# EAGLE board OSD62-PM-BRK (EAGLE 9.6.2), part 1 of 3
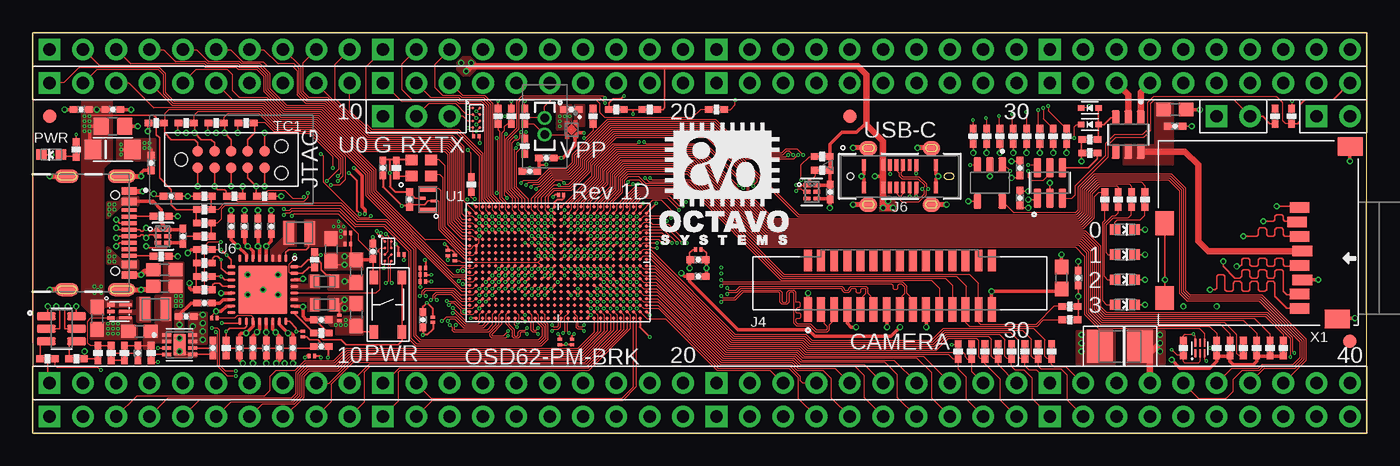
[diagram p9: board, top side]
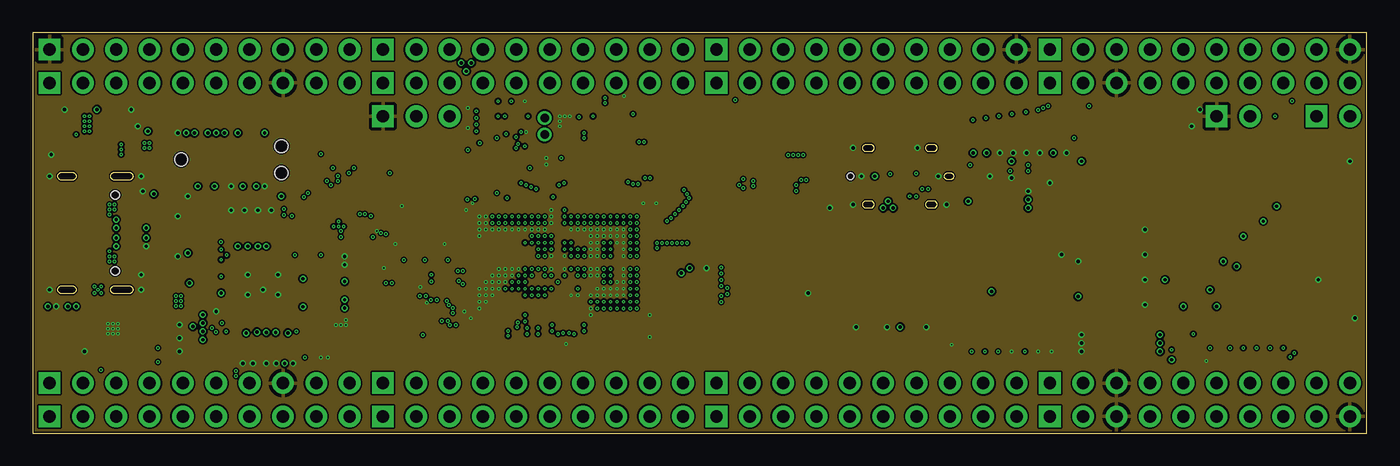
[diagram p10: board, inner layer Route2]
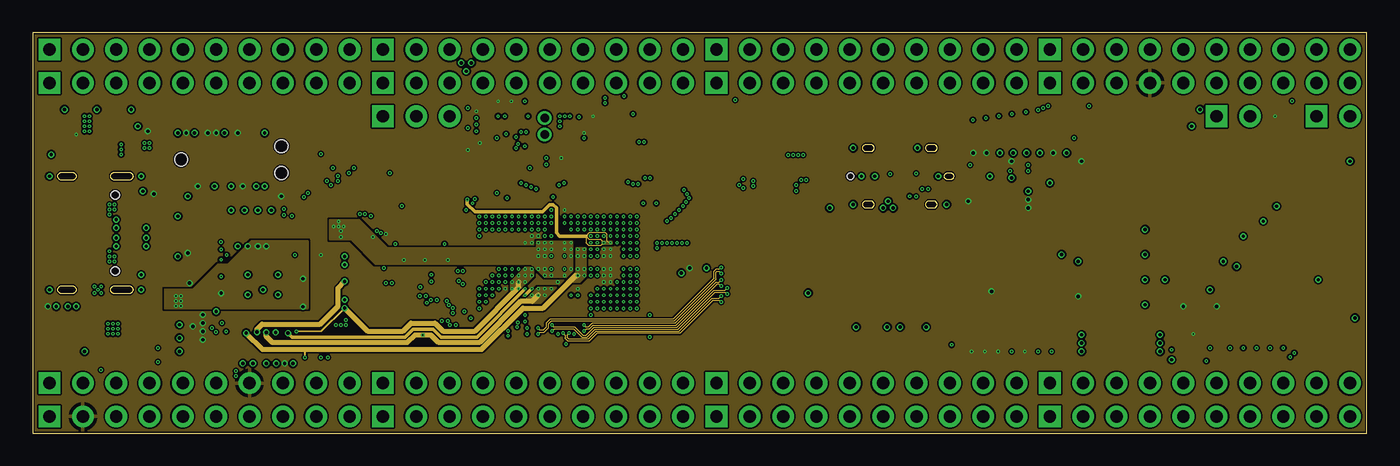
[diagram p11: board, inner layer Route15]
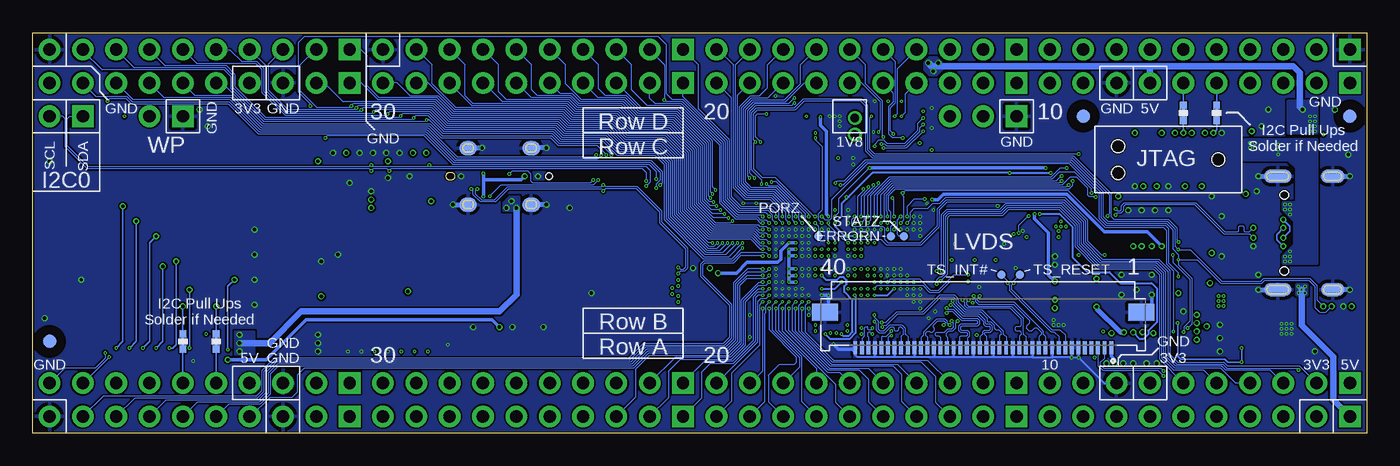
[diagram p12: board, bottom side, seen from below]

Size 101.6 x 30.48 mm. Coordinates in mm from the lower left corner, seen from the top.
Outline: 0,0 101.6,0 101.6,30.48 0,30.48 0,0
Copper layers (1+2*15+16): Top 0.035mm / dielectric 0.23mm / Route2 0.035mm / dielectric 0.93mm / Route15 0.035mm / dielectric 0.23mm / Bottom 0.035mm
Design rules "OSD32MP15x-BRK_Board_4lyr *": minimum track width 3mil, minimum drill 4mil, track to track 3mil, track to pad 3mil, pad to pad 3mil, via to via 3mil, smd to smd 3mil, copper to edge 5mil, drill to drill 4mil, minimum pad ring 3mil, minimum via ring 3mil, stop-mask expansion 3mil, vias tented up to drill 25mil, thermal gap 10mil

## Footprints (pad centres in the part's own frame; a part is rotated, then mirrored left to right if it is on the bottom)
C0201 = smd 0.23 x 0.34: 1 -0.205,0; 2 0.205,0
C0402 = smd 0.61 x 0.508: 1 -0.559,0; 2 0.559,0
B/3528-21R = smd 1.95 x 2.5: + 1.525,0; - -1.525,0
C0603 = smd 1.1 x 1: 1 -0.85,0; 2 0.85,0
C0805 = smd 1.143 x 1.27: 1 -0.889,0; 2 0.889,0
EIA-STD = smd 0.787 x 0.787: 1 -0.749,0; 2 0.749,0
RB520S30T1G = smd 0.48 x 0.4: ANODE 0.66,0; CATHODE -0.66,0
SOD-123FL = smd 1.25 x 1.5: A 1.5,0; C -1.5,0
FIDUCIAL_40MIL = smd 1.016 x 1.016: P$1 0,0
H1X2-1.27 = drill 0.65 pad 1.05: 1 -0.635,0; 2 0.635,0
H1X2-2.54 = drill 0.94 pad 1.651 square: 1 0,1.27 | drill 0.94 pad 1.651: 2 0,-1.27
TE_1-1734248-5 = smd 0.6 x 1.85: 1 -7,-2.025; 2 -6,-2.025; 3 -5,-2.025; 4 -4,-2.025; 5 -3,-2.025; 6 -2,-2.025; 7 -1,-2.025; 8 0,-2.025; 9 1,-2.025; 10 2,-2.025; 11 3,-2.025; 12 4,-2.025; 13 5,-2.025; 14 6,-2.025; 15 7,-2.025 | smd 0.6 x 1.65: 1_1 -7,1.725; 2_1 -6,1.725; 3_1 -5,1.725; 4_1 -4,1.725; 5_1 -3,1.725; 6_1 -2,1.725; 7_1 -1,1.725; 8_1 0,1.725; 9_1 1,1.725; 10_1 2,1.725; 11_1 3,1.725; 12_1 4,1.725; 13_1 5,1.725; 14_1 6,1.725; 15_1 7,1.725
GCT_USB4105-GF-A = smd 0.6 x 1.15: A1_B12 -3.2,4.755; A4_B9 -2.4,4.755; B1_A12 3.2,4.755; B4_A9 2.4,4.755 | smd 0.3 x 1.15: A5 -1.25,4.755; A6 -0.25,4.755; A7 0.25,4.755; A8 1.25,4.755; B5 1.75,4.755; B6 0.75,4.755; B7 -0.75,4.755; B8 -1.75,4.755 | smd 1 x 2.1 bottom: SH1_B -4.32,4.18; SH2_B 4.32,4.18 | smd 1 x 2.1: SH1_T -4.32,4.18; SH2_T 4.32,4.18 | smd 1 x 1.8 bottom: SH3_B 4.32,0; SH4_B -4.32,0 | smd 1 x 1.8: SH3_T 4.32,0; SH4_T -4.32,0 | hole 0.65: 2.89,3.68; -2.89,3.68
MOLEX_2171820001 = smd 0.3 x 0.87: A1 -2.75,0.865; A4 -1.25,0.865; A5 -0.75,0.865; A6 -0.25,0.865; A7 0.25,0.865; A8 0.75,0.865; A9 1.25,0.865; A12 2.75,0.865; B1 2.75,-0.865; B4 1.25,-0.865; B5 0.75,-0.865; B6 0.25,-0.865; B7 -0.25,-0.865; B8 -0.75,-0.865; B9 -1.25,-0.865; B12 -2.75,-0.865 | smd 1.35 x 1.1 bottom: SH_B_1 -2.4,2.15; SH_B_2 2.4,2.15; SH_B_3 2.4,-2.15; SH_B_4 -2.4,-2.15 | smd 1.35 x 1.1: SH_T_1 -2.4,2.15; SH_T_2 2.4,2.15; SH_T_3 2.4,-2.15; SH_T_4 -2.4,-2.15 | hole 0.52: -3.75,0
MOLEX_505110-4091 = smd 0.3 x 1: 1 -9.75,2.425; 2 -9.25,2.425; 3 -8.75,2.425; 4 -8.25,2.425; 5 -7.75,2.425; 6 -7.25,2.425; 7 -6.75,2.425; 8 -6.25,2.425; 9 -5.75,2.425; 10 -5.25,2.425; 11 -4.75,2.425; 12 -4.25,2.425; 13 -3.75,2.425; 14 -3.25,2.425; 15 -2.75,2.425; 16 -2.25,2.425; 17 -1.75,2.425; 18 -1.25,2.425; 19 -0.75,2.425; 20 -0.25,2.425; 21 0.25,2.425; 22 0.75,2.425; 23 1.25,2.425; 24 1.75,2.425; 25 2.25,2.425; 26 2.75,2.425; 27 3.25,2.425; 28 3.75,2.425; 29 4.25,2.425; 30 4.75,2.425; 31 5.25,2.425; 32 5.75,2.425; 33 6.25,2.425; 34 6.75,2.425; 35 7.25,2.425; 36 7.75,2.425; 37 8.25,2.425; 38 8.75,2.425; 39 9.25,2.425; 40 9.75,2.425 | smd 2 x 1.3: S1 -12.05,-0.275; S2 12.05,-0.275
H1X3-2.54 = drill 0.94 pad 1.651 square: 1 0,2.54 | drill 0.94 pad 1.651: 2 0,0; 3 0,-2.54
H1X40-2.54 = drill 0.94 pad 1.651 square: 1 0,49.53; 11 0,24.13; 21 0,-1.27; 31 0,-26.67 | drill 0.94 pad 1.651: 2 0,46.99; 3 0,44.45; 4 0,41.91; 5 0,39.37; 6 0,36.83; 7 0,34.29; 8 0,31.75; 9 0,29.21; 10 0,26.67; 12 0,21.59; 13 0,19.05; 14 0,16.51; 15 0,13.97; 16 0,11.43; 17 0,8.89; 18 0,6.35; 19 0,3.81; 20 0,1.27; 22 0,-3.81; 23 0,-6.35; 24 0,-8.89; 25 0,-11.43; 26 0,-13.97; 27 0,-16.51; 28 0,-19.05; 29 0,-21.59; 30 0,-24.13; 32 0,-29.21; 33 0,-31.75; 34 0,-34.29; 35 0,-36.83; 36 0,-39.37; 37 0,-41.91; 38 0,-44.45; 39 0,-46.99; 40 0,-49.53
L0806 = smd 0.8 x 1.8: 1 -0.8,0; 2 0.8,0
L0603 = smd 0.7 x 1: 1 -0.75,0; 2 0.75,0
R0402 = smd 0.61 x 0.508: 1 -0.559,0; 2 0.559,0
TACT4.2MM = smd 1.05 x 0.65: P$1 -2.075,1.075; P$2 2.075,1.075; P$3 -2.075,-1.075; P$4 2.075,-1.075
TC2050-IDC-NL = smd 0.787 x 0.787: 1 -2.54,-0.635; 2 -1.27,-0.635; 3 0,-0.635; 4 1.27,-0.635; 5 2.54,-0.635; 6 2.54,0.635; 7 1.27,0.635; 8 0,0.635; 9 -1.27,0.635; 10 -2.54,0.635 | hole 0.991: -3.81,0; 3.81,1.016; 3.81,-1.016
TP_B0,65 = smd 0.635 x 0.635: TP 0,0
OSD6254-BGA-500 = smd 0.25 x 0.25: A2 -6.25,4.25; A3 -5.75,4.25; A4 -5.25,4.25; A5 -4.75,4.25; A6 -4.25,4.25; A7 -3.75,4.25; A8 -3.25,4.25; A9 -2.75,4.25; A10 -2.25,4.25; A11 -1.75,4.25; A12 -1.25,4.25; A13 -0.75,4.25; A14 -0.25,4.25; A15 0.25,4.25; A16 0.75,4.25; A17 1.25,4.25; A18 1.75,4.25; A19 2.25,4.25; A20 2.75,4.25; A21 3.25,4.25; A22 3.75,4.25; A23 4.25,4.25; A24 4.75,4.25; A25 5.25,4.25; A26 5.75,4.25; A27 6.25,4.25; B1 -6.75,3.75; B2 -6.25,3.75; B3 -5.75,3.75; B4 -5.25,3.75; B5 -4.75,3.75; B6 -4.25,3.75; B7 -3.75,3.75; B8 -3.25,3.75; B9 -2.75,3.75; B10 -2.25,3.75; B11 -1.75,3.75; B12 -1.25,3.75; B13 -0.75,3.75; B14 -0.25,3.75; B15 0.25,3.75; B16 0.75,3.75; B17 1.25,3.75; B18 1.75,3.75; B19 2.25,3.75; B20 2.75,3.75; B21 3.25,3.75; B22 3.75,3.75; B23 4.25,3.75; B24 4.75,3.75; B25 5.25,3.75; B26 5.75,3.75; B27 6.25,3.75; B28 6.75,3.75; C1 -6.75,3.25; C2 -6.25,3.25; C3 -5.75,3.25; C4 -5.25,3.25; C5 -4.75,3.25; C6 -4.25,3.25; C7 -3.75,3.25; C8 -3.25,3.25; C9 -2.75,3.25; C10 -2.25,3.25; C11 -1.75,3.25; C12 -1.25,3.25; C13 -0.75,3.25; C14 -0.25,3.25; C15 0.25,3.25; C16 0.75,3.25; C17 1.25,3.25; C18 1.75,3.25; C19 2.25,3.25; C20 2.75,3.25; C21 3.25,3.25; C22 3.75,3.25; C23 4.25,3.25; C24 4.75,3.25; C25 5.25,3.25; C26 5.75,3.25; C27 6.25,3.25; C28 6.75,3.25; D1 -6.75,2.75; D2 -6.25,2.75; D3 -5.75,2.75; D4 -5.25,2.75; D5 -4.75,2.75; D6 -4.25,2.75; D7 -3.75,2.75; D8 -3.25,2.75; D9 -2.75,2.75; D10 -2.25,2.75; D11 -1.75,2.75; D12 -1.25,2.75; D13 -0.75,2.75; D14 -0.25,2.75; D15 0.25,2.75; D16 0.75,2.75; D17 1.25,2.75; D18 1.75,2.75; D19 2.25,2.75; D20 2.75,2.75; D21 3.25,2.75; D22 3.75,2.75; D23 4.25,2.75; D24 4.75,2.75; D25 5.25,2.75; D26 5.75,2.75; D27 6.25,2.75; D28 6.75,2.75; E1 -6.75,2.25; E2 -6.25,2.25; E3 -5.75,2.25; E4 -5.25,2.25; E5 -4.75,2.25; E6 -4.25,2.25; E7 -3.75,2.25; E8 -3.25,2.25; E9 -2.75,2.25; E10 -2.25,2.25; E11 -1.75,2.25; E12 -1.25,2.25; E13 -0.75,2.25; E14 -0.25,2.25; E15 0.25,2.25; E16 0.75,2.25; E17 1.25,2.25; E18 1.75,2.25; E19 2.25,2.25; E20 2.75,2.25; E21 3.25,2.25; E22 3.75,2.25; E23 4.25,2.25; E24 4.75,2.25; E25 5.25,2.25; E26 5.75,2.25; E27 6.25,2.25; E28 6.75,2.25; F1 -6.75,1.75; F2 -6.25,1.75; F3 -5.75,1.75; F4 -5.25,1.75; F5 -4.75,1.75; F6 -4.25,1.75; F7 -3.75,1.75; F8 -3.25,1.75; F9 -2.75,1.75; F10 -2.25,1.75; F11 -1.75,1.75; F12 -1.25,1.75; F13 -0.75,1.75; F14 -0.25,1.75; F15 0.25,1.75; F16 0.75,1.75; F17 1.25,1.75; F18 1.75,1.75; F19 2.25,1.75; F20 2.75,1.75; F21 3.25,1.75; F22 3.75,1.75; F23 4.25,1.75; F24 4.75,1.75; F25 5.25,1.75; F26 5.75,1.75; F27 6.25,1.75; F28 6.75,1.75; G1 -6.75,1.25; G2 -6.25,1.25; G3 -5.75,1.25; G4 -5.25,1.25; G5 -4.75,1.25; G6 -4.25,1.25; G7 -3.75,1.25; G8 -3.25,1.25; G9 -2.75,1.25; G10 -2.25,1.25; G11 -1.75,1.25; G12 -1.25,1.25; G13 -0.75,1.25; G14 -0.25,1.25; G15 0.25,1.25; G16 0.75,1.25; G17 1.25,1.25; G18 1.75,1.25; G19 2.25,1.25; G20 2.75,1.25; G21 3.25,1.25; G22 3.75,1.25; G23 4.25,1.25; G24 4.75,1.25; G25 5.25,1.25; G26 5.75,1.25; G27 6.25,1.25; G28 6.75,1.25; H1 -6.75,0.75; H2 -6.25,0.75; H3 -5.75,0.75; H4 -5.25,0.75; H5 -4.75,0.75; H6 -4.25,0.75; H7 -3.75,0.75; H8 -3.25,0.75; H9 -2.75,0.75; H10 -2.25,0.75; H11 -1.75,0.75; H12 -1.25,0.75; H13 -0.75,0.75; H14 -0.25,0.75; H15 0.25,0.75; H16 0.75,0.75; H17 1.25,0.75; H18 1.75,0.75; H19 2.25,0.75; H20 2.75,0.75; H21 3.25,0.75; H22 3.75,0.75; H23 4.25,0.75; H24 4.75,0.75; H25 5.25,0.75; H26 5.75,0.75; H27 6.25,0.75; H28 6.75,0.75; J1 -6.75,0.25; J2 -6.25,0.25; J3 -5.75,0.25; J4 -5.25,0.25; J5 -4.75,0.25; J6 -4.25,0.25; J7 -3.75,0.25; J8 -3.25,0.25; J9 -2.75,0.25; J10 -2.25,0.25; J11 -1.75,0.25; J12 -1.25,0.25; J13 -0.75,0.25; J14 -0.25,0.25; J15 0.25,0.25; J16 0.75,0.25; J17 1.25,0.25; J18 1.75,0.25; J19 2.25,0.25; J20 2.75,0.25; J21 3.25,0.25; J22 3.75,0.25; J23 4.25,0.25; J24 4.75,0.25; J25 5.25,0.25; J26 5.75,0.25; J27 6.25,0.25; J28 6.75,0.25; K1 -6.75,-0.25; K2 -6.25,-0.25; K3 -5.75,-0.25; K4 -5.25,-0.25; K5 -4.75,-0.25; K6 -4.25,-0.25; K7 -3.75,-0.25; K8 -3.25,-0.25; K9 -2.75,-0.25; K10 -2.25,-0.25; K11 -1.75,-0.25; K12 -1.25,-0.25; K13 -0.75,-0.25; K14 -0.25,-0.25; K15 0.25,-0.25; K16 0.75,-0.25; K17 1.25,-0.25; K18 1.75,-0.25; K19 2.25,-0.25; K20 2.75,-0.25; K21 3.25,-0.25; K22 3.75,-0.25; K23 4.25,-0.25; K24 4.75,-0.25; K25 5.25,-0.25; K26 5.75,-0.25; K27 6.25,-0.25; K28 6.75,-0.25; L1 -6.75,-0.75; L2 -6.25,-0.75; L3 -5.75,-0.75; L4 -5.25,-0.75; L5 -4.75,-0.75; L6 -4.25,-0.75; L7 -3.75,-0.75; L8 -3.25,-0.75; L9 -2.75,-0.75; L10 -2.25,-0.75; L11 -1.75,-0.75; L12 -1.25,-0.75; L13 -0.75,-0.75; L14 -0.25,-0.75; L15 0.25,-0.75; L16 0.75,-0.75; L17 1.25,-0.75; L18 1.75,-0.75; L19 2.25,-0.75; L20 2.75,-0.75; L21 3.25,-0.75; L22 3.75,-0.75; L23 4.25,-0.75; L24 4.75,-0.75; L25 5.25,-0.75; L26 5.75,-0.75; L27 6.25,-0.75; L28 6.75,-0.75; M1 -6.75,-1.25; M2 -6.25,-1.25; M3 -5.75,-1.25; M4 -5.25,-1.25; M5 -4.75,-1.25; M6 -4.25,-1.25; M7 -3.75,-1.25; M8 -3.25,-1.25; M9 -2.75,-1.25; M10 -2.25,-1.25; M11 -1.75,-1.25; M12 -1.25,-1.25; M13 -0.75,-1.25; M14 -0.25,-1.25; M15 0.25,-1.25; M16 0.75,-1.25; M17 1.25,-1.25; M18 1.75,-1.25; M19 2.25,-1.25; M20 2.75,-1.25; M21 3.25,-1.25; M22 3.75,-1.25; M23 4.25,-1.25; M24 4.75,-1.25; M25 5.25,-1.25; M26 5.75,-1.25; M27 6.25,-1.25; M28 6.75,-1.25; N1 -6.75,-1.75; N2 -6.25,-1.75; N3 -5.75,-1.75; N4 -5.25,-1.75; N5 -4.75,-1.75; N6 -4.25,-1.75; N7 -3.75,-1.75; N8 -3.25,-1.75; N9 -2.75,-1.75; N10 -2.25,-1.75; N11 -1.75,-1.75; N12 -1.25,-1.75; N13 -0.75,-1.75; N14 -0.25,-1.75; N15 0.25,-1.75; N16 0.75,-1.75; N17 1.25,-1.75; N18 1.75,-1.75; N19 2.25,-1.75; N20 2.75,-1.75; N21 3.25,-1.75; N22 3.75,-1.75; N23 4.25,-1.75; N24 4.75,-1.75; N25 5.25,-1.75; N26 5.75,-1.75; N27 6.25,-1.75; N28 6.75,-1.75; P1 -6.75,-2.25; P2 -6.25,-2.25; P3 -5.75,-2.25; P4 -5.25,-2.25; P5 -4.75,-2.25; P6 -4.25,-2.25; P7 -3.75,-2.25; P8 -3.25,-2.25; P9 -2.75,-2.25; P10 -2.25,-2.25; P11 -1.75,-2.25; P12 -1.25,-2.25; P13 -0.75,-2.25; P14 -0.25,-2.25; P15 0.25,-2.25; P16 0.75,-2.25; P17 1.25,-2.25; P18 1.75,-2.25; P19 2.25,-2.25; P20 2.75,-2.25; P21 3.25,-2.25; P22 3.75,-2.25; P23 4.25,-2.25; P24 4.75,-2.25; P25 5.25,-2.25; P26 5.75,-2.25; P27 6.25,-2.25; P28 6.75,-2.25; R1 -6.75,-2.75; R2 -6.25,-2.75; R3 -5.75,-2.75; R4 -5.25,-2.75; R5 -4.75,-2.75; R6 -4.25,-2.75; R7 -3.75,-2.75; R8 -3.25,-2.75; R9 -2.75,-2.75; R10 -2.25,-2.75; R11 -1.75,-2.75; R12 -1.25,-2.75; R13 -0.75,-2.75; R14 -0.25,-2.75; R15 0.25,-2.75; R16 0.75,-2.75; R17 1.25,-2.75; R18 1.75,-2.75; R19 2.25,-2.75; R20 2.75,-2.75; R21 3.25,-2.75; R22 3.75,-2.75; R23 4.25,-2.75; R24 4.75,-2.75; R25 5.25,-2.75; R26 5.75,-2.75; R27 6.25,-2.75; R28 6.75,-2.75; T1 -6.75,-3.25; T2 -6.25,-3.25; T3 -5.75,-3.25; T4 -5.25,-3.25; T5 -4.75,-3.25; T6 -4.25,-3.25; T7 -3.75,-3.25; T8 -3.25,-3.25; T9 -2.75,-3.25; T10 -2.25,-3.25; T11 -1.75,-3.25; T12 -1.25,-3.25; T13 -0.75,-3.25; T14 -0.25,-3.25; T15 0.25,-3.25; T16 0.75,-3.25; T17 1.25,-3.25; T18 1.75,-3.25; T19 2.25,-3.25; T20 2.75,-3.25; T21 3.25,-3.25; T22 3.75,-3.25; T23 4.25,-3.25; T24 4.75,-3.25; T25 5.25,-3.25; T26 5.75,-3.25; T27 6.25,-3.25; T28 6.75,-3.25; U1 -6.75,-3.75; U2 -6.25,-3.75; U3 -5.75,-3.75; U4 -5.25,-3.75; U5 -4.75,-3.75; U6 -4.25,-3.75; U7 -3.75,-3.75; U8 -3.25,-3.75; U9 -2.75,-3.75; U10 -2.25,-3.75; U11 -1.75,-3.75; U12 -1.25,-3.75; U13 -0.75,-3.75; U14 -0.25,-3.75; U15 0.25,-3.75; U16 0.75,-3.75; U17 1.25,-3.75; U18 1.75,-3.75; U19 2.25,-3.75; U20 2.75,-3.75; U21 3.25,-3.75; U22 3.75,-3.75; U23 4.25,-3.75; U24 4.75,-3.75; U25 5.25,-3.75; U26 5.75,-3.75; U27 6.25,-3.75; U28 6.75,-3.75; V2 -6.25,-4.25; V3 -5.75,-4.25; V4 -5.25,-4.25; V5 -4.75,-4.25; V6 -4.25,-4.25; V7 -3.75,-4.25; V8 -3.25,-4.25; V9 -2.75,-4.25; V10 -2.25,-4.25; V11 -1.75,-4.25; V12 -1.25,-4.25; V13 -0.75,-4.25; V14 -0.25,-4.25; V15 0.25,-4.25; V16 0.75,-4.25; V17 1.25,-4.25; V18 1.75,-4.25; V19 2.25,-4.25; V20 2.75,-4.25; V21 3.25,-4.25; V22 3.75,-4.25; V23 4.25,-4.25; V24 4.75,-4.25; V25 5.25,-4.25; V26 5.75,-4.25; V27 6.25,-4.25
DRY6 = smd 0.55 x 0.3: 1 -0.355,0.5 | smd 0.52 x 0.3: 2 -0.37,0; 3 -0.37,-0.5; 4 0.37,-0.5; 5 0.37,0; 6 0.37,0.5
DMQ0006A = smd 0.6 x 0.25: 1 -0.65,0.5; 2 -0.65,0; 3 -0.65,-0.5 | smd 1 x 0.2: 4 0.45,-0.5; 5 0.45,0; 6 0.45,0.5
SOT95P280X145-5N = smd 1.1 x 0.6: 1 -1.4,0.95; 2 -1.4,0; 3 -1.4,-0.95; 4 1.4,-0.95; 5 1.4,0.95
SON50P200X200X80-9N = smd 0.76 x 0.28: 1 -0.985,0.75; 2 -0.985,0.25; 3 -0.985,-0.25; 4 -0.985,-0.75; 5 0.985,-0.75; 6 0.985,-0.25; 7 0.985,0.25; 8 0.985,0.75 | smd 0.9 x 1.6: 9 0,0
RHB0032W = smd 0.6 x 0.25: 1 -2.4,1.75; 2 -2.4,1.25; 3 -2.4,0.75; 4 -2.4,0.25; 5 -2.4,-0.25; 6 -2.4,-0.75; 7 -2.4,-1.25; 8 -2.4,-1.75; 17 2.4,-1.75; 18 2.4,-1.25; 19 2.4,-0.75; 20 2.4,-0.25; 21 2.4,0.25; 22 2.4,0.75; 23 2.4,1.25; 24 2.4,1.75 | smd 0.25 x 0.6: 9 -1.75,-2.4; 10 -1.25,-2.4; 11 -0.75,-2.4; 12 -0.25,-2.4; 13 0.25,-2.4; 14 0.75,-2.4; 15 1.25,-2.4; 16 1.75,-2.4; 25 1.75,2.4; 26 1.25,2.4; 27 0.75,2.4; 28 0.25,2.4; 29 -0.25,2.4; 30 -0.75,2.4; 31 -1.25,2.4; 32 -1.75,2.4 | smd 3.7 x 3.7: PAD 0,0
SOT95P280X110-6N = smd 1.45 x 0.59: 1 -1.155,0.95; 2 -1.155,0; 3 -1.155,-0.95; 4 1.155,-0.95; 5 1.155,0; 6 1.155,0.95
SOT95P280X145-6N = smd 1.1 x 0.6: 1 -1.3,0.95; 2 -1.3,0; 3 -1.3,-0.95; 4 1.3,-0.95; 5 1.3,0; 6 1.3,0.95
SON35P100X100X40-6N = smd 0.6 x 0.17: 1 -0.4,0.35; 2 -0.4,0; 3 -0.4,-0.35; 4 0.4,-0.35; 5 0.4,0; 6 0.4,0.35
YZP0008 = smd 0.23 x 0.23: A1 -0.25,0.75; A2 0.25,0.75; B1 -0.25,0.25; B2 0.25,0.25; C1 -0.25,-0.25; C2 0.25,-0.25; D1 -0.25,-0.75; D2 0.25,-0.75
DQN0004A = smd 0.05 x 0.05: 1 -0.43,0.325; 2 -0.43,-0.325; 3 0.43,-0.325; 4 0.43,0.325; 5 0,0
MF-MICROSD = smd 1.4 x 1.9: G0 -6.589,7.001; G1 6.561,6.001 | smd 0.8 x 1.5: PIN1 -1.939,3.151; PIN2 -0.839,2.951; PIN3 0.261,3.151; PIN4 1.361,3.351; PIN5 2.461,3.151; PIN6 3.561,3.351; PIN7 4.661,3.151; PIN8 5.761,3.151 | smd 1.8 x 1.4: PIN9 4.961,-7.149; PIN10 -0.739,-7.149
SIT1533AI_2X1.2MM = smd 0.4 x 1.4: 1 -0.8,0; 3 0.8,0 | smd 0.2 x 0.5: 2 -0.1,-0.45; 4 0.1,0.45
QFN-4-2X1.6MM = smd 0.9 x 0.8: 1 -0.75,-0.6; 2 0.75,-0.6; 3 0.75,0.6; 4 -0.75,0.6

## Placement (x,y rotation side)
C1  0.1uF  [C0201]  30.48,8.64 90 top
C2  0.1uF  [C0201]  41.07,6.93 270 top
C3  0.1uF  [C0201]  40.23,18.14 0 top
C4  1uF  [C0402]  29.72,8.64 90 top
C5  4.7uF  [C0402]  21.97,6.6 0 top
C6  0.1uF  [C0201]  50.67,13.97 0 top
C7  0.1uF  [C0201]  23.37,8.76 270 top
C8  0.1uF  [C0201]  29.72,12.06 180 top
C9  0.1uF  [C0201]  20.57,7.54 270 top
C10  0.1uF  [C0201]  31.62,13.72 90 top
C11  0.1uF  [C0201]  24,15.24 0 top
C12  0.1uF  [C0201]  28.07,13.59 180 top
C13  0.1uF  [C0201]  32.13,13.34 90 top
C14  0.1uF  [C0201]  24,14.4 0 top
C15  0.1uF  [C0201]  29.72,12.57 180 top
C16  10uF  [C0402]  25.91,13.84 270 top
C17  0.1uF  [C0201]  21.26,5.87 0 top
C18  0.1uF  [C0201]  13.84,8.76 180 top
C19  0.1uF  [C0201]  40.16,6.93 270 top
C20  0.1uF  [C0201]  29.72,11.56 180 top
C21  2.2uF  [C0402]  37.85,19.94 0 top
C22  2.2uF  [C0402]  50.67,13.21 0 top
C23  2.2uF  [C0402]  50.67,11.94 0 top
C24  0.1uF  [C0402]  60.73,18.36 270 top
C25  220uF  [B/3528-21R]  82.8,6.6 0 top
C26  0.1uF  [C0402]  75.18,17.91 90 top
C27  10uF  [C0603]  4.9,8.74 270 top
C28  DNP  [C0402]  13.72,6.48 270 top
C29  0.1uF  [C0402]  11.68,8.89 180 top
C30  120pF  [C0402]  8,6.1 90 top
C31  10uF  [C0603]  10.03,11.18 180 top
C32  10uF  [C0603]  10.03,12.45 180 top
C33  10uF  [C0603]  8.13,7.75 180 top
C34  0.1uF  [C0402]  10.54,18.03 0 top
C35  0.1uF  [C0402]  75.18,20.19 270 top
C36  0.1uF  [C0402]  79.63,11.81 90 top
C37  10uF  [C0603]  78.36,11.81 90 top
C38  10uF  [C0402]  16.76,6.48 270 top
C39  10uF  [C0402]  18.8,6.48 270 top
C40  10uF  [C0402]  16.13,15.75 90 top
C41  2.2uF  [C0402]  13.08,9.91 180 top
C42  10uF  [C0402]  15.11,15.75 90 top
C43  10uF  [C0402]  15.75,6.48 270 top
C44  10uF  [C0402]  17.78,6.48 270 top
C45  10uF  [C0402]  19.81,6.48 270 top
C46  0.1uF  [C0402]  28.7,17.78 270 top
C47  47uF  [C0603]  24.64,9.02 270 top
C48  22uF  [C0402]  21.97,8.64 0 top
C49  47uF  [C0603]  24.64,12.32 90 top
C50  0.1uF  [C0402]  11.43,14.99 270 top
C51  10uF  [C0402]  17.14,15.75 90 top
C52  22uF  [C0402]  18.16,15.75 90 top
C53  47uF  [C0603]  22.73,13.97 270 top
C54  0.1uF  [C0402]  26.67,20.19 270 top
C55  0.1uF  [C0402]  6.1,24.64 0 top
C56  47uF  [C0805]  6.1,23.37 0 top
C57  10uF  [C0603]  87,24.64 0 top
C58  0.1uF  [C0402]  87,23.37 0 top
C59  1nF  [C0402]  3.68,24.64 180 top
C60  4.7uF  [C0402]  9.02,20.57 270 top
C61  0.1uF  [C0201]  33.78,22.61 180 top
C62  1uF  [C0402]  41.02,24.64 180 top
C63  1uF  [C0402]  39.12,20.95 180 top
D1  RED  [EIA-STD]  1.4,21.21 180 top
D2  GREEN  [EIA-STD]  83.19,11.68 0 top
D3  GREEN  [EIA-STD]  83.19,9.78 0 top
D4  GREEN  [EIA-STD]  83.19,13.59 0 top
D5  GREEN  [EIA-STD]  83.19,15.49 0 top
D6  RB520S30T1G  [RB520S30T1G]  80.52,23.5 0 top
D7  RB520S30T1G  [RB520S30T1G]  80.52,24.77 0 top
D8  RBS2MM40C  [SOD-123FL]  6.1,21.59 0 top
FUD1  FIDUCIAL  [FIDUCIAL_40MIL]  100.33,6.99 0 top
FUD2  FIDUCIAL  [FIDUCIAL_40MIL]  1.27,24.13 90 top
FUD3  FIDUCIAL  [FIDUCIAL_40MIL]  1.27,24.13 90 bottom
FUD4  FIDUCIAL  [FIDUCIAL_40MIL]  100.33,6.99 0 bottom
FUD5  FIDUCIAL  [FIDUCIAL_40MIL]  21.59,24.13 90 bottom
FUD6  FIDUCIAL  [FIDUCIAL_40MIL]  62.23,24.13 90 top
J1  [H1X2-1.27]  38.99,23.37 270 top
J2  [H1X2-2.54]  91.44,24.13 90 top
J4  1-1734248-5  [TE_1-1734248-5]  66.04,11.43 0 top
J5  USB4105-GF-A  [GCT_USB4105-GF-A]  2.6,15.24 270 top
J6  2171820001  [MOLEX_2171820001]  66.04,19.56 0 top
J7  [H1X2-2.54]  99.06,24.13 90 top
J8  505110-4091  [MOLEX_505110-4091]  29.21,8.92 180 bottom
JP1  [H1X3-2.54]  29.21,24.13 90 top
JP2  [H1X40-2.54]  50.8,1.27 90 top
JP3  [H1X40-2.54]  50.8,3.81 90 top
JP4  [H1X40-2.54]  50.8,26.67 90 top
JP5  [H1X40-2.54]  50.8,29.21 90 top
L1  0.47uH  [L0806]  9.35,9.45 0 top
L2  0.47uH  [L0603]  22.23,9.78 0 top
L3  0.47uH  [L0603]  22.23,11.56 0 top
L4  0.47uH  [L0806]  20.32,15.24 0 top
R1  10k  [R0402]  44.45,24.64 0 top
R2  100k  [R0402]  46.99,24.64 0 top
R3  10k  [R0402]  37.47,24.13 270 top
R4  10k  [R0402]  13.08,14.99 180 top
R5  20k  [R0402]  13.08,16 180 top
R6  100k  [R0402]  4.95,6.1 90 top
R7  10k  [R0402]  94.61,24.13 90 top
R8  270k  [R0402]  5.97,6.1 90 top
R9  180k  [R0402]  6.99,6.1 270 top
R10  10k  [R0402]  33.4,18.92 90 top
R11  10k  [R0402]  42.67,24.13 90 top
R12  2k  [R0402]  78.99,9.65 0 top
R13  10k  [R0402]  13.08,10.92 180 top
R14  10k  [R0402]  11.68,23.62 0 top
R15  10k  [R0402]  3.33,5.66 180 top
R16  10k  [R0402]  80.52,21.34 180 top
R17  10k  [R0402]  13.97,23.62 180 top
R18  10k  [R0402]  15.37,18.03 0 top
R19  10k  [R0402]  17.65,18.03 0 top
R20  10k  [R0402]  16.26,23.62 180 top
R21  10k  [R0402]  9.4,23.62 180 top
R22  10k  [R0402]  21.97,7.62 0 top
R23  10k  [R0402]  21.46,13.21 90 top
R24  10k  [R0402]  14.73,6.48 270 top
R25  10k  [R0402]  13.08,11.94 180 top
R26  10k  [R0402]  77.6,6.22 90 top
R27  10k  [R0402]  76.58,6.22 90 top
R28  10k  [R0402]  75.56,6.22 90 top
R29  10k  [R0402]  74.55,6.22 90 top
R30  10k  [R0402]  73.53,6.22 90 top
R31  10k  [R0402]  72.52,6.22 90 top
R32  10k  [R0402]  71.5,6.22 90 top
R33  22  [R0402]  92.2,6.48 270 top
R34  10k  [R0402]  70.48,6.22 90 top
R35  5.1K  [R0402]  9.78,16.51 180 top
R36  5.1K  [R0402]  9.78,13.46 180 top
R37  10k  [R0402]  78.74,22.61 270 top
R38  10k  [R0402]  77.72,22.61 270 top
R39  10k  [R0402]  76.71,22.61 270 top
R40  10k  [R0402]  75.69,22.61 270 top
R41  10k  [R0402]  74.68,22.61 270 top
R42  10k  [R0402]  73.66,22.61 270 top
R43  10k  [R0402]  95.25,6.48 270 top
R44  10k  [R0402]  94.23,6.48 270 top
R45  10k  [R0402]  93.22,6.48 270 top
R46  10k  [R0402]  91.19,6.48 270 top
R47  10k  [R0402]  90.17,6.48 270 top
R48  10k  [R0402]  87.63,6.48 90 top
R49  10k  [R0402]  72.64,22.61 270 top
R50  10k  [R0402]  27.69,20.19 270 top
R51  10k  [R0402]  71.63,22.61 270 top
R52  4.7k  [R0402]  13.08,12.95 180 top
R53  4.7k  [R0402]  13.08,13.97 180 top
R54  10k  [R0402]  80.52,22.35 0 top
R55  0  [R0402]  95.89,24.13 270 top
R56  0  [R0402]  1.12,5.66 180 top
R57  1k  [R0402]  3.3,21.59 90 top
R58  1k  [R0402]  82.68,17.78 90 top
R59  1k  [R0402]  81.66,17.78 90 top
R60  1k  [R0402]  83.69,17.78 90 top
R61  1k  [R0402]  84.71,17.78 90 top
R62  20k  [R0402]  13.08,17.02 180 top
R63  10k  [R0402]  13.08,18.03 180 top
R64  2k  [R0402]  78.99,8.64 0 top
R65  2k  [R0402]  36.45,24.13 90 top
R66  2k  [R0402]  35.43,24.13 90 top
R67  DNP  [R0402]  11.43,24.38 270 bottom
R68  DNP  [R0402]  13.97,24.38 270 bottom
R69  DNP  [R0402]  90.17,6.99 90 bottom
R70  DNP  [R0402]  87.63,6.99 90 bottom
R71  56K  [R0402]  60.12,21.06 0 top
R72  56K  [R0402]  60.12,20.02 0 top
R73  10k  [R0402]  9.02,6.1 90 top
R74  0  [R0402]  52.07,24.64 0 top
R76  10k  [R0402]  37.47,21.84 270 top
S1  MF-SW-TACT-4.2MM  [TACT4.2MM]  27.05,9.78 270 top
TC1  TC2050-IDC-NL  [TC2050-IDC-NL]  15.11,20.83 0 top
TP1  TPB0,65  [TP_B0,65]  41.75,15 90 bottom
TP2  TPB0,65  [TP_B0,65]  36.25,15 90 bottom
TP3  TPB0,65  [TP_B0,65]  35.25,15 90 bottom
TP6  TPB0,65  [TP_B0,65]  26.42,12.06 0 bottom
TP7  TPB0,65  [TP_B0,65]  27.81,12.06 0 bottom
U1  OSD6254-1G-IPM  [OSD6254-BGA-500]  40,13 0 top
U2  TPD4S012_DRY_6_P1_P  [DRY6]  59.33,18.36 0 top
U3  TLV62595DMQR  [DMQ0006A]  6.6,9.27 0 top
U4  24AA32AT-I/OT  [SOT95P280X145-5N]  72.9,19.05 270 top
U5  TPS22965DSGT  [SON50P200X200X80-9N]  11.18,6.73 0 top
U6  TPS6521903RHB  [RHB0032W]  17.53,10.92 270 top
U7  ADC121C027CIMK  [SOT95P280X110-6N]  2.18,7.95 0 top
U8  ADC121C027CIMK  [SOT95P280X110-6N]  77.47,19.05 90 top
U9  TPD4S012_DRY_6_P1_P  [DRY6]  9.91,14.99 0 top
U10  TPS22918DBVR  [SOT95P280X145-6N]  83.44,22.73 270 top
U11  SN74LVC1G04DSFR  [SON35P100X100X40-6N]  88.9,6.48 90 top
U12  SN74LVC2G241YZPR  [YZP0008]  33.78,24 0 top
U13  SN74LVC2G241YZPR  [YZP0008]  27.05,13.84 0 top
U14  TLV75518PDQNR  [DQN0004A]  41.02,23.11 270 top
U$1  [OCTAVO-LOGO-8VO]  48.13,17.27 0 top
U$2  [OCTAVO-LOGO-WORDS-SMALL]  47.62,14.22 0 top
X1  MF-MICROSD  [MF-MICROSD]  93.34,15.24 270 top
Y1  SIT1533AI-H4-D14-32.768  [SIT1533AI_2X1.2MM]  30.1,17.78 90 top
Y2  SIT8008BI-73-YYS-25.000000  [QFN-4-2X1.6MM]  29.59,20.19 0 top

## Tracks (layer width: path | path; a pad name or v marks a point on that pad's centre or on a via)
3V3_FB
  Top 0.076: R6.2 4.39,6.66 4.19,6.86 4.19,8.53 4.43,8.77 U3.3
  Top 0.127: R6.2 R8.2 5.97,6.22 6.1,6.1 7.87,6.1 8,5.97 C30.1
3V3_FB_0
  Top 0.127: R8.1 R9.2
3V3_SW
  pour Top (no thermals): 6.6,9.27 8,9.27 8,10.29 8.89,10.29 8.89,8.51 8,8.51 8,9.14 6.6,9.14
ADC0_ADDR
  Top 0.127: R15.2 2.77,6.83 2.94,7 U7.4
ADC1_ADDR
  Top 0.127: U8.4 80.4,20.2 81.08,20.88 R16.1
BUCK1-0P75  (via drill 0.1 pad 0.25)
  Top 0.076: C13.1 32.51,13.13 32.64,13 38.5,13 | 38.5,13 U1.K12 | U1.J12 38.5,13
  Top 0.127: U6.1 19.28,13.78 19.47,13.97 20.83,13.97 20.99,14.13 20.99,15.11 L4.2 | C10.1 v31.62,13.18
  Top 0.152: U1.K12 v38.5,12.5 | U1.K13 v39,12.5 | U1.L13 v39,12 U1.M12 | U1.L14 v39.5,12 U1.M13 | U1.L15 v40.5,12 | U1.K16 v41,12.5 | U1.G12 v38.5,14.5 | U1.H12 v38.5,14 | U1.J12 v38.5,13.5 | U1.J13 v39,13.5 | U1.H13 v39,14 | U1.G14 v39.5,14.5 | U1.H14 v39.5,14 | U1.H15 v40.5,14 | U1.G15 v40.5,14.5 | U1.H16 v41,14 | U1.J16 v41,13.5 | U1.G16 v41,14.5 | U1.G13 v39,14.5 | C15.1 29.92,13.13 v29.87,13.18 | C12.1 v28.27,13.18
  Top 0.254: C16.1 v25.91,14.94
  other vias: 23.67,15.72 23.47,15.39 22.91,15.72 23.29,15.72 23.47,14.94 23.29,16.1
  pour Top (no thermals): 20.7,14.22 20.7,16.26 23.24,16.26 23.88,15.62 23.88,14.22
  pour Route15: 41.12,14.62 41.12,12.38 40.62,11.88 39,11.88 38,12.88 26.12,12.88 24.27,14.73 22.61,14.73 22.61,16.26 24.87,16.26 27,14.12 38.38,14.12 38.38,14.62
BUCK2-1P8  (via drill 0.1 pad 0.25, 0.25 pad 0.46)
  Top 0.076: U1.C15 v40.5,16.5
  Top 0.127: L3.2 22.98,11.7 22.61,12.06 22.35,12.06 21.97,12.45 21.97,12.95 21.72,13.21 20.95,13.21 20.42,12.67 U6.32
  Top 0.254: C38.1 16.76,7.37 17.07,7.67 v17.07,7.7 17.28,7.9 U6.20 | v24.46,20.19 25.07,19.58 25.07,17.22 25.3,16.99 v25.3,16.69 | C49.1 24.55,11.56 v23.75,11.56 | C21.1 37.72,19.94 37.85,20.07 v37.85,20.19
  Route15 0.381: v17.07,7.7 17.07,7.93 17.45,8.31 21.89,8.31 23.24,9.65 23.24,11.05 v23.75,11.56
  Bottom 0.076: v37.85,20.19 37.87,20.19 40.23,17.83 40.23,16.77 v40.5,16.5
  Bottom 0.254: v37.85,20.19 v24.46,20.19 | v23.75,11.56 24.23,12.04 24.23,15.24 25.3,16.31 v25.3,16.69
  pour Top (no thermals): 22.48,10.92 25.15,10.92 25.15,12.06 22.48,12.06
BUCK3-1P2  (via drill 0.1 pad 0.25, 0.25 pad 0.46)
  Top 0.127: U6.24 19.55,8.52 20.07,8 v20.07,7.75 C9.1
  Top 0.152: U1.M8 v36.5,11.5 | U1.N8 v36.5,11 | U1.N9 v37,11 | U1.M10 v37.5,11.5 | U1.M9 v37,11.5 | U1.L10 v37.5,12 | U1.L11 v38,12 | U1.K11 v38,12.5 | U1.L9 v37,12 | U1.K10 v37.5,12.5 | C7.1 23.37,9.78 v23.75,10.16 | C8.1 v30.35,12.06
  Route15 0.127: v20.07,7.75 21.97,7.75 v23.75,9.53
  Route15 0.381: v23.75,9.53 25.5,7.77 28.19,7.77 28.8,8.38 30.63,8.38 31.24,7.77 33.68,7.77 37,11.09 v37,11.5
  Bottom 0.076: v36.5,11.5 36.25,11.75 34.08,11.75 33.22,10.9 32.61,10.9 31.45,12.06 v30.35,12.06
  pour Top (no thermals): 22.48,10.41 25.15,10.41 25.15,9.27 22.48,9.27
  pour Route15 (rank 2): 36.38,11.5 37.5,12.62 38.12,12.62 38.12,12 37,10.88 36.38,10.88
CH1_LVDS_A0N  (via drill 0.1 pad 0.25)
  Top 0.076: U1.P2 33.5,10.5 32.63,10.5 32.08,11.05 29.87,11.05 29.64,10.82 29.64,10.59 v29.49,10.44
  Bottom 0.076: v29.49,10.44 29.64,10.29 29.64,10.13 29.49,9.98 26.82,9.98 24.61,7.77 24.61,7.54 24.46,7.39 J8.11
CH1_LVDS_A0P  (via drill 0.1 pad 0.25)
  Top 0.076: U1.R1 32.65,10.25 32,10.9 29.95,10.9 29.79,10.74 29.79,10.59 v29.95,10.44
  Bottom 0.076: v29.95,10.44 29.79,10.29 29.79,10.06 29.57,9.83 26.9,9.83 25.68,8.61 25.68,8.38 25.91,8.15 25.91,8 25.68,7.77 25.53,7.77 25.3,8 25.07,8 24.77,7.7 24.77,7.54 24.96,7.35 J8.12
CH1_LVDS_A1N  (via drill 0.1 pad 0.25)
  Top 0.076: U1.R2 33.5,10 32.67,10 31.93,10.74 30.71,10.74 30.48,10.52 30.48,10.29 v30.33,10.13
  Bottom 0.076: v30.33,10.13 30.48,9.98 30.48,9.83 30.33,9.68 27.05,9.68 26.14,8.76 26.14,7.54 25.96,7.37 J8.14
CH1_LVDS_A1P  (via drill 0.1 pad 0.25)
  Top 0.076: U1.T1 32.69,9.75 31.85,10.59 30.79,10.59 30.63,10.44 30.63,10.29 v30.79,10.13
  Bottom 0.076: v30.79,10.13 30.63,9.98 30.63,9.75 30.4,9.53 27.13,9.53 26.29,8.69 26.29,8.23 26.36,8.15 26.67,8.15 26.75,8.08 26.75,7.85 26.67,7.77 26.36,7.77 26.29,7.7 26.29,7.54 26.46,7.37 J8.15
CH1_LVDS_A2N  (via drill 0.1 pad 0.25)
  Top 0.076: U1.T2 33.5,9.5 32.72,9.5 32.16,10.06 v31.55,10.06
  Bottom 0.076: v31.55,10.06 31.55,9.98 30.63,9.07 29.49,9.07 29.03,8.61 29.03,8.38 28.96,8.31 28.65,8.31 28.5,8.15 28.5,7.85 28.65,7.7 29.03,7.7 29.11,7.62 29.11,7.54 28.96,7.39 J8.20
CH1_LVDS_A2P  (via drill 0.1 pad 0.25)
  Top 0.076: U1.U2 33.5,9 32.76,9 32.61,9.14 32.61,9.37 32.08,9.91 31.85,9.91 v31.7,9.75
  Bottom 0.076: v31.7,9.75 31.55,9.75 30.71,8.91 29.57,8.91 29.18,8.53 29.18,8.31 29.03,8.15 28.73,8.15 28.65,8.08 28.65,7.92 28.73,7.85 29.11,7.85 29.26,7.7 29.26,7.54 29.46,7.34 J8.21
CH1_LVDS_A3N  (via drill 0.1 pad 0.25)
  Top 0.076: U1.U3 34,9 34,8.62 33.83,8.46 33.07,8.46 v32,9.53
  Bottom 0.076: v32,9.53 31.93,9.45 31.47,9.45 30.79,8.76 29.64,8.76 29.49,8.61 29.49,8.31 29.64,8.15 30.86,8.15 30.94,8.08 30.94,7.92 30.86,7.85 30.4,7.85 30.25,7.7 30.25,7.39 30.4,7.24 30.4,6.55 J8.23
CH1_LVDS_A3P  (via drill 0.1 pad 0.25)
  Top 0.076: U1.V3 34.25,8.65 33.91,8.31 32.99,8.31 32.16,9.14 v32,9.14
  Bottom 0.076: v32,9.14 31.85,9.3 31.55,9.3 30.86,8.61 29.72,8.61 29.64,8.53 29.64,8.38 29.72,8.31 30.94,8.31 31.09,8.15 31.09,7.85 30.94,7.7 30.48,7.7 30.4,7.62 30.4,7.47 30.48,7.39 30.94,7.39 31.01,7.32 31.01,6.54 J8.24
CH1_LVDS_CLKN  (via drill 0.1 pad 0.25)
  Top 0.076: v36.94,8.43 36.94,8.61 37,8.66 37,9 U1.U8
  Bottom 0.076: v36.94,8.43 36.6,8.43 35.81,9.22 33.83,9.22 32.54,10.52 31.37,10.52 31.09,10.23 31.09,9.98 30.48,9.37 29.26,9.37 27.66,7.77 27.66,7.54 27.46,7.34 J8.17
CH1_LVDS_CLKP  (via drill 0.1 pad 0.25)
  Top 0.076: U1.V8 36.75,8.58 36.65,8.48 36.65,8.31 v36.88,8.08
  Bottom 0.076: v36.88,8.08 36.73,8.23 36.58,8.23 35.74,9.07 33.76,9.07 32.46,10.36 31.43,10.36 31.24,10.17 31.24,9.91 30.56,9.22 29.34,9.22 28.88,8.76 28.88,8.53 28.8,8.46 28.57,8.46 28.35,8.23 28.35,8 28.19,7.85 27.96,7.85 27.81,7.7 27.81,7.54 27.96,7.4 J8.18
CH2_LVDS_A0N  (via drill 0.1 pad 0.25)
  Top 0.076: U1.U4 34.5,9 34.5,8.44 34.21,8.15 32.92,8.15 32.23,8.84 31.47,8.84 v31.17,8.53
  Bottom 0.076: v31.17,8.53 31.32,8.38 31.32,8 31.55,7.77 31.85,7.77 32,7.62 32,7.39 31.88,7.27 31.88,6.57 J8.26
CH2_LVDS_A0P  (via drill 0.1 pad 0.25)
  Top 0.076: U1.V4 34.75,8.46 34.29,8 32.84,8 32.16,8.69 31.77,8.69 v31.62,8.53
  Bottom 0.076: v31.62,8.53 31.47,8.38 31.47,8.08 31.62,7.92 31.93,7.92 32.16,7.7 32.77,7.7 32.84,7.62 32.84,7.47 32.77,7.39 32.53,7.39 32.46,7.32 J8.27
CH2_LVDS_A1N  (via drill 0.1 pad 0.25)
  Top 0.076: U1.U5 35,9 35,8.25 34.6,7.85 32.16,7.85 32.08,7.92 32.08,8.08 v32.23,8.23
  Bottom 0.076: v32.23,8.23 32.08,8.38 32.08,8.46 32.16,8.53 32.69,8.53 32.99,8.23 32.99,8.08 32.92,8 32.92,7.85 33.07,7.7 33.22,7.7 33.3,7.77 33.45,7.77 33.6,7.62 33.6,7.47 33.46,7.32 J8.29
CH2_LVDS_A1P  (via drill 0.1 pad 0.25)
  Top 0.076: U1.V5 35.25,8.25 34.7,7.7 32.08,7.7 31.93,7.85 31.93,8.08 v31.77,8.23
  Bottom 0.076: v31.77,8.23 31.93,8.38 31.93,8.53 32.08,8.69 32.77,8.69 33.76,7.7 33.76,7.47 33.96,7.26 J8.30
CH2_LVDS_A2N  (via drill 0.1 pad 0.25)
  Top 0.076: U1.U6 35.5,9 35.5,8.28 34.82,7.61 34.82,7.39 34.98,7.24 36.02,7.24 v36.2,7.42
  Bottom 0.076: v36.2,7.42 36.32,7.42 36.46,7.28 J8.35
CH2_LVDS_A2P  (via drill 0.1 pad 0.25)
  Top 0.076: v36.2,7.77 35.81,7.39 35.05,7.39 34.98,7.47 34.98,7.54 35.75,8.32 U1.V6
  Bottom 0.076: v36.2,7.77 36.58,7.39 36.88,7.39 36.96,7.31 J8.36
CH2_LVDS_A3N  (via drill 0.1 pad 0.25)
  Top 0.076: U1.U7 36,9 36,8.35 36.5,7.85 36.5,7.39 36.65,7.24 36.96,7.24 37.11,7.39 37.11,7.62 37.19,7.7 37.49,7.7 v37.64,7.54
  Bottom 0.076: v37.64,7.54 37.8,7.7 37.95,7.7 38.02,7.62 38.02,7.39 37.96,7.33 J8.38
CH2_LVDS_A3P  (via drill 0.1 pad 0.25)
  Top 0.076: U1.V7 36.25,8.33 36.65,7.92 36.65,7.47 36.73,7.39 36.88,7.39 36.96,7.47 36.96,7.7 37.11,7.85 37.49,7.85 v37.64,8
  Bottom 0.076: v37.64,8 37.8,7.85 37.9,7.85 37.97,7.92 37.97,8.05 38.04,8.12 38.16,8.12 38.24,8.04 38.24,7.4 38.46,7.18 J8.39
CH2_LVDS_CLKN  (via drill 0.1 pad 0.25)
  Top 0.076: U1.U9 v37.5,9
  Bottom 0.076: v37.5,9 37.5,8.84 37.19,8.53 37.19,7.92 37.03,7.77 36.8,7.77 36.35,8.23 35.37,8.23 35.13,7.99 35.13,7.54 34.96,7.38 J8.32
CH2_LVDS_CLKP  (via drill 0.1 pad 0.25)
  Top 0.076: U1.V9 v37.5,8.5
  Bottom 0.076: v37.5,8.5 37.34,8.34 37.34,7.85 37.11,7.62 36.73,7.62 36.27,8.08 36.04,8.08 35.97,8 35.97,7.86 35.88,7.77 35.75,7.77 35.66,7.86 35.66,8 35.59,8.08 35.43,8.08 35.28,7.92 35.28,7.54 35.46,7.36 J8.33
CLICK0_AN
  Top 0.127: JP3.1 1.14,3.94 1.14,5.38 0.86,5.66 R56.2 0.56,6.81 0.51,6.86 0.65,7 U7.3
CLICK1_AN
  Top 0.076: U8.3 79.16,17.89 79.4,18.14 79.4,18.82 81.69,21.11 81.69,22.02 82.37,22.71 84.51,22.71 84.89,23.09 84.89,25.15 85.34,25.6 94.77,25.6 95.22,25.15 95.22,23.77 95.43,23.57 R55.2
  Top 0.127: R55.2 96.34,23.57 96.52,23.75 96.52,25.02 96.9,25.4 99.06,25.4 JP4.40
CSI0_RXCLKN  (via drill 0.1 pad 0.25)
  Top 0.076: J4.8 66.22,9.58 66.22,10.44 66.45,10.67 66.45,11.12 66.22,11.35 65.99,11.35 65.91,11.28 65.91,11.05 65.84,10.97 65.61,10.97 65.53,11.05 65.53,11.28 65.46,11.35 52.58,11.35 v52.43,11.2 | v41.99,7.77 41.83,7.92 41.53,7.92 41.38,8.08 41.38,8.46 41.25,8.59 U1.V17
  Route15 0.076: v52.43,11.2 52.27,11.35 52.12,11.35 49,8.23 42.67,8.23 42.37,7.92 42.14,7.92 v41.99,7.77
CSI0_RXCLKP  (via drill 0.1 pad 0.25)
  Top 0.076: J4.9 66.83,9.62 66.83,10.44 66.6,10.67 66.6,11.2 66.29,11.51 52.58,11.51 v52.43,11.66 | v41.99,8.23 41.83,8.08 41.6,8.08 41.53,8.15 41.53,8.53 41.5,8.56 41.5,8.85 41.25,9.1 U1.U17
  Route15 0.076: v52.43,11.66 52.27,11.51 52.05,11.51 48.92,8.38 42.6,8.38 42.29,8.08 42.14,8.08 v41.99,8.23
CSI0_RXN0  (via drill 0.1 pad 0.25)
  Top 0.076: J4.2 60.27,9.17 60.27,8.38 60.5,8.15 60.5,7.92 60.43,7.85 59.74,7.85 59.28,8.31 58.29,8.31 58.14,8.46 58.14,8.69 58.22,8.76 58.45,8.76 58.52,8.84 58.52,9.07 58.45,9.14 58.22,9.14 58.14,9.22 58.14,9.45 58.27,9.58 58.41,9.58 58.48,9.65 58.48,9.88 58.41,9.96 58.17,9.96 58.14,9.98 58.14,10.74 57.99,10.9 57.61,10.9 57.45,10.74 57.45,10.06 57.38,9.98 57.15,9.98 57.07,10.06 57.07,10.74 56.92,10.9 54.03,10.9 53.42,10.29 52.58,10.29 v52.43,10.44 | U1.V16 40.75,8.52 40.69,8.46 40.69,7.77 v40.84,7.62
  Route15 0.076: v52.43,10.44 52.27,10.29 51.74,10.29 49.23,7.77 42.9,7.77 42.29,7.16 40.84,7.16 40.69,7.32 40.69,7.47 v40.84,7.62
CSI0_RXN1  (via drill 0.1 pad 0.25)
  Top 0.076: J4.5 63.25,9.61 63.25,10.44 63.48,10.67 63.48,10.97 63.4,11.05 63.17,11.05 63.09,10.97 63.09,10.76 63.02,10.68 62.79,10.68 62.71,10.76 62.71,10.97 62.64,11.05 62.41,11.05 62.33,10.97 62.33,10.87 62.18,10.72 61.8,10.72 61.65,10.87 61.65,10.97 61.57,11.05 53.95,11.05 53.65,10.74 53.03,10.74 v52.88,10.59 | v39.55,7.77 39.7,7.92 40.01,7.92 40.16,8.08 40.16,8.51 40.25,8.6 U1.V15
  Route15 0.076: v52.88,10.59 52.73,10.74 51.97,10.74 49.15,7.92 42.82,7.92 42.22,7.32 41.83,7.32 41.22,7.92 39.7,7.92 v39.55,7.77
CSI0_RXP0  (via drill 0.1 pad 0.25)
  Top 0.076: J4.3 60.88,9.25 60.88,8.46 60.66,8.23 60.66,7.85 60.5,7.7 59.66,7.7 59.21,8.15 58.22,8.15 57.99,8.38 57.99,10.67 57.91,10.74 57.68,10.74 57.61,10.67 57.61,9.98 57.45,9.83 57.07,9.83 56.92,9.98 56.92,10.67 56.84,10.74 54.1,10.74 53.49,10.13 52.58,10.13 v52.43,9.98 | v40.39,7.62 40.54,7.77 40.54,8.46 40.5,8.5 40.5,8.85 40.75,9.1 U1.U16
  Route15 0.076: v52.43,9.98 52.27,10.13 51.82,10.13 49.3,7.62 42.98,7.62 42.37,7.01 40.77,7.01 40.54,7.24 40.54,7.47 v40.39,7.62
CSI0_RXP1  (via drill 0.1 pad 0.25)
  Top 0.076: J4.6 63.86,9.59 63.86,10.44 63.63,10.67 63.63,11.05 63.48,11.2 62.33,11.2 62.18,11.05 62.18,10.95 62.1,10.87 61.87,10.87 61.8,10.95 61.8,11.05 61.65,11.2 53.87,11.2 53.57,10.9 53.03,10.9 v52.88,11.05 | v39.55,8.23 39.7,8.08 39.93,8.08 40.01,8.15 40.01,8.85 40.25,9.1 U1.U15
  Route15 0.076: v52.88,11.05 52.73,10.9 51.89,10.9 49.07,8.08 42.75,8.08 42.14,7.47 41.91,7.47 41.3,8.08 39.7,8.08 v39.55,8.23
EEPROM_WP
  Top 0.076: U4.5 74.73,16.76 79.4,16.76 79.63,16.99 79.63,18.75 81.92,21.03 81.92,21.95 82.45,22.48 84.58,22.48 85.11,23.01 85.11,25.07 85.42,25.38 91.47,25.38 J2.2
  Top 0.127: R7.1 94.23,23.57 93.67,24.13 J2.2
EMU0  (via drill 0.1 pad 0.25)
  Top 0.076: U1.D8 v36.5,16 | v22.4,19.2 23.32,20.12 23.32,20.8 21.18,22.94 18.36,22.94 17.68,23.62 R20.1
  Top 0.127: TC1.7 16.38,22.35 16.89,22.86 16.89,23.55 R20.1
  Bottom 0.076: v36.5,16 36.25,16.25 36.25,16.82 36.42,16.99 36.42,18.06 35.89,18.59 22.63,18.59 22.4,18.82 v22.4,19.2
EMU1  (via drill 0.1 pad 0.25)
  Top 0.076: U1.C8 v36.5,16.5 | v22.71,18.9 23.39,18.9 23.77,19.28 23.77,21.03 21.41,23.39 18.59,23.39 17.37,24.61 10.36,24.61 10.06,24.31 10.06,23.72 R21.1
  Top 0.127: R21.1 10.03,23.55 10.03,22.86 10.54,22.35 12.32,22.35 12.57,22.1 TC1.10
  Bottom 0.076: v22.71,18.9 22.86,18.75 35.97,18.75 36.6,18.11 36.6,16.94 36.5,16.84 v36.5,16.5
EXT_REFCLK1  (via drill 0.1 pad 0.25)
  Top 0.076: R56.1 1.68,5.18 1.83,5.03 4.95,5.03 v5.18,4.8 | U1.D16 v41,16
  Bottom 0.076: v41,16 41,15.88 39.88,14.75 37,14.75 36.58,14.33 33.91,14.33 32.54,15.7 32.54,16.99 31.93,17.6 23.09,17.6 21.57,16.08 21.57,14.48 20.19,13.11 15.93,13.11 15.16,12.34 15.16,5.94 14.48,5.26 10.97,5.26 10.67,4.95 5.33,4.95 v5.18,4.8
EXTINTN  (via drill 0.1 pad 0.25)
  Top 0.076: U1.C17 v41.5,16.5
  Top 0.127: U6.11 15.11,11.68 14.61,11.68 v14.35,11.94 R25.1
  Bottom 0.076: v41.5,16.5 U1.C17 40.88,16.25 40.75,16.38 40.75,17.77 38.02,20.5 22.63,20.5 20.34,18.21 20.34,16.31 19.81,15.77 15.32,15.77 15.09,15.54 15.09,12.95 14.35,12.22 v14.35,11.94
GND  (via drill 0.1 pad 0.25, 0.25 pad 0.46)
  Top 0.076: U1.H2 33.5,13.5 32.91,13.5 30.94,15.47 30.94,17.6 30.86,17.68 Y1.2 | R34.2 70.43,6.73 v69.98,6.73 | R29.2 v74.55,6.22 | R27.2 v76.58,6.22 | R26.2 v77.6,6.22 | U11.3 89.25,5.62 v89.38,5.49 | 30.35,19.58 30.43,19.66 31.01,19.66 31.24,19.43 31.24,15.62 32.85,14.01 33.35,14.01 33.59,14.25 U1.G2 34,14.5 v34,15 | U5.5 11.42,5.98 v11.18,6.22 | C18.2 13.64,8.94 v13.97,9.27 | U12.A1 33.16,24.75 v33.15,24.77 | U12.D1 | U12.D1 v33.15,23.24 | C61.2 33.52,22.66 U12.D1 | U13.A1 26.78,14.59 26.21,15.16 v26.21,15.39 | U13.D1 26.8,12.86 26.75,12.8 v26.75,12.57 | R76.1 37.47,22.84 v37.57,22.94 | R3.1 v37.47,25.27
  Top 0.127: v11.05,16.51 R35.1 | v11.05,13.46 R36.1 | TC1.5 v17.65,18.8 | TC1.3 v15.11,18.8 | R14.1 11.05,23.55 v11.05,22.86 | R37.2 v78.74,21.34 | R39.2 v76.71,21.34 | R40.2 v75.69,21.34 | R41.2 v74.68,21.34 | R42.2 v73.66,21.34 | J4.10 | J4.7 65.08,9.37 | Y1.2 30.13,17.68 29.84,17.4 28.88,17.4 C46.2 | 30.35,19.58 Y2.2 | v23.75,12.83 23.03,12.83 C53.2 | v23.75,13.46 24.23,13.46 | 24.23,13.46 24.34,13.46 C49.2 | C29.2 11.18,8.84 v11.18,8.26 | C50.2 11.43,14.86 11.56,14.99 R4.2 | v1.4,21.21 D1.2 | U4.2 v72.9,19.56 | v74.55,19.43 74.98,19.43 C35.2 | v75.82,18.41 75.23,18.41 C26.2 | v77.47,19.05 U8.2 | v79.63,13.08 C36.2 | D5.2 v84.71,15.49 | D4.2 v84.71,13.59 | D2.2 v84.71,11.68 | D3.2 v84.71,9.78 | v88.27,23.37 C58.2 | U9.4 10.28,14.23 10.14,14.1 8.76,14.1 v8.64,14.22 | U7.2 2,7.95 2.03,7.99 2.03,9.4 v1.78,9.65 | v3.94,6.22 3.94,5.71 R15.1 4.83,5.66 R6.1 | C34.2 v11.81,18.03 R63.2 | U5.5 12.2,6.02 13.61,6.02 C28.2 | 24.23,13.46 24.23,14.38 C14.2 24.23,14.43 24.23,15.22 C11.2 | C9.2 20.86,7.34 21.08,7.11 21.72,7.11 21.97,6.86 21.97,6.73 22.1,6.6 C5.2 | S1.P$4 25.1,7.7 C47.2 | C6.2 51.05,13.97 51.31,13.72 51.31,13.28 C22.2 | S1.P$3 25.91,11.92 C16.2 | C13.2 32.13,13.74 31.95,13.92 C10.2 31.62,14.15 v31.37,14.4 | v45.03,25.68 44.81,25.45 44.2,25.45 43.89,25.15 R1.1
  Top 0.152: U1.U1 v32.88,9.25 | U1.V2 v33.38,8.75 | U1.T3 v34,9.5 | U1.R3 v34,10 | U1.R4 v34.5,10 | U1.P4 v34.5,10.5 | U1.P5 v35,10.5 | U1.N5 v35,11 | U1.N6 v35.5,11 | U1.M6 v35.5,11.5 | U1.M7 v36,11.5 | U1.L7 v36,12 | U1.L8 v36.5,12 | U1.D3 v34,16 | U1.B1 v33,17 | U1.A2 v33.5,17.5 | U1.D4 v34.5,16 | U1.C4 v34.5,16.5 | U1.E6 v35.5,15.5 | U1.D14 v39.5,16 | U1.C14 v39.5,16.5 | U1.K8 v36.5,12.5 | U1.K9 v37,12.5 | U1.P16 v41,10.5 | U1.U19 v42.5,9 U1.V19 | U1.P21 v43.5,10.5 | v43.5,11 U1.N21 | U1.N22 v44,11 | U1.N23 v44.5,11 | U1.P24 v45,10.5 | U1.N24 v45,11 | U1.K15 v40.5,12.5 | U1.L19 v42.5,12 | U1.K19 v42.5,12.5 | U1.L20 v43,12 U1.M20 | U1.J14 v39.5,13.5 | U1.J15 v40.5,13.5 | U1.E20 v43,15.5 | U1.E21 v43.5,15.5 | U1.F20 v43,15 | U1.F21 v43.5,15 | U1.F23 v44.5,15 | U1.G20 v43,14.5 | U1.G23 v44.5,14.5 | U1.G24 v45,14.5 | U1.H24 v45,14 | U1.J24 v45,13.5 | U1.J19 v42.5,13.5 | U1.H19 v42.5,14 | U1.A27 v46.5,17.5 | U1.B28 v47.5,17.5 | v47,7.31 46.25,8.06 U1.V27 | v47,9 U1.U28 | U1.E10 v37.5,15.5 | U1.E12 v38.5,15.5 | U1.E13 v39,15.5 | U1.E18 v42,15.5 | U1.G19 v42.5,14.5 | U1.E19 v42.5,15.5 | U1.E22 v44,15.5 | U1.F22 v44,15 | U1.H20 v43,14 | U1.E23 v44.5,15.5 | U1.P19 v42.5,10.5 | U1.P20 v43,10.5 | U1.P22 v44,10.5 | U1.P23 v44.5,10.5 | U1.M24 v45,11.5 | U1.K14 v39.5,12.5 | U1.C3 v34,16.5 | U1.E9 v37,15.5 | U1.E11 v38,15.5 | U1.E3 v34,15.5 | U1.E4 v34.5,15.5 | U1.E5 v35,15.5 | U1.E7 v36,15.5 | U1.E8 v36.5,15.5 | U1.E16 v41,15.5 | U1.E17 v41.5,15.5 | U1.P3 v34,10.5 | U1.N3 v34,11 | U1.N4 v34.5,11 | U1.M4 v34.5,11.5 | U1.M5 v35,11.5 | U1.L5 v35,12 | U1.L6 v35.5,12 | U1.K6 v35.5,12.5 | U1.K7 v36,12.5 | U1.K20 v43,12.5 | U1.J20 v43,13.5 | U1.F19 v42.5,15 | U1.E24 v45,15.5 | U1.F24 v45,15 | U1.K24 v45,12.5 | U1.L24 v45,12 | U1.M23 v44.5,11.5 | U1.N20 v43,11 | U1.P17 v41.5,10.5 U1.P18 | U1.T19 v42.5,9.5
  Top 0.152: U1.B14 v39.5,17 U1.A14 39.75,17.58 39.93,17.75 40.31,17.75 40.44,17.88 C3.2 | C54.2 26.67,18.75 v28.12,17.3 28.63,17.3 C46.2 | v21.95,5.77 21.84,5.87 C17.2 | C5.2 22.48,6.55 v22.48,5.77 | C4.2 29.72,9.63 v30.02,9.93 30.48,9.47 C1.2 | U1.G2 U1.H2 | C19.2 40.56,6.73 v40.62,6.78 40.67,6.73 C2.2 | C15.2 C8.2 C20.2 v29.51,11.13 v29.52,11.12 | C12.2 27.86,14.15 v27.61,14.4 | C63.2 v39.12,20.95 | 38.56,20.45 v39.12,20.45
  Top 0.254: U9.4 11.37,14.49 C50.2 | U6.15 14.75,9.67 14.35,9.27 v13.97,9.27 | C42.2 v15.11,16.97 | C40.2 v16.13,16.97 | C51.2 v17.14,16.97 | C52.2 v18.16,16.97 | C45.2 v19.81,5.31 | C39.2 18.8,5.56 v18.54,5.31 | C44.2 v17.78,5.31 | C38.2 v16.76,5.31 | v16,5.31 15.75,5.56 C43.2 | X1.G0 100.35,21.7 100.33,21.69 v100.33,20.7 | X1.G1 99.43,8.76 v100.71,8.76 | C29.2 11.12,8.97 12.06,9.91 C41.2 | v97.92,11.68 X1.PIN6 | J4.10 v68.05,8.08 | 65.08,9.37 v65.08,8.08 | v62.71,8.08 62.33,8.08 62.04,8.37 J4.4 | J4.1 59.05,9.42 v59.05,10.67 | J6.A1 63.29,19.73 v63.12,19.56 63.29,19.39 J6.B12 | J6.A12 68.79,19.73 v68.96,19.56 68.79,19.39 J6.B1 | U2.4 60.67,17.86 C24.2 60.71,17.78 v60.71,17.14 | C37.2 v78.36,13.59 | v88.9,24.64 C57.2 | C23.2 51.31,12.01 v51.31,12.57 51.31,13.13 C22.2 | C16.2 25.83,13.21 24.68,13.21 C49.2 | C55.2 v7.49,24.64 | v2.41,24.64 C59.2 | C56.2 v8,23.37 | C60.2 8.46,20.02 8.26,19.81 v8.26,19.56 | C21.2 38.56,20.09 38.56,20.45 C63.2
  Top 0.381: J5.SH3_B v1.27,10.92 | J5.B1_A12 7.38,12.06 v8.26,12.06 8.51,12.32 9.06,12.32 C32.2 | J5.A1_B12 7.38,18.41 v8.38,18.41 | J5.SH1_T v8.26,19.56 | v1.27,19.56 J5.SH4_T | J5.SH2_B v8.26,10.92 8.93,10.92 C31.2 | J6.SH_B_1 v62.48,21.72 | J6.SH_B_4 v62.48,17.4 | v69.6,17.4 J6.SH_T_3 | J6.SH_T_2 v67.39,21.72
  Top 0.508: U10.2 83.44,25.78 JP4.33
  Bottom 0.152: v22.48,5.77 22.48,5.87 | v21.95,5.77 19.99,3.81 JP3.8 | J8.6 21.95,6.48 21.95,5.87 | 21.95,5.87 v21.95,5.77 | 22.4,5.79 22.45,5.79 v22.48,5.77 | 22.4,5.79 22.02,5.79 | 22.02,5.79 21.97,5.79 v21.95,5.77 | v22.48,5.77 22.5,5.79 22.55,5.79 | 38.94,6.17 38.94,5.94 38.79,5.79 37.57,5.79 | 22.55,5.79 23.85,5.79 | 23.93,5.79 23.85,5.79 | 25.45,5.79 25.38,5.79 | 25.38,5.79 24,5.79 | 24,5.79 23.93,5.79 | 25.45,5.79 25.53,5.79 | 25.53,5.79 26.9,5.79 | 26.9,5.79 26.98,5.79 | 26.98,5.79 27.05,5.79 | 27.05,5.79 28.35,5.79 | 28.35,5.79 28.42,5.79 | 28.42,5.79 28.5,5.79 | 28.5,5.79 29.87,5.79 | 29.87,5.79 29.95,5.79 | 29.95,5.79 30.02,5.79 | 30.02,5.79 31.39,5.79 | 31.39,5.79 31.47,5.79 | 31.47,5.79 31.55,5.79 | 31.55,5.79 32.84,5.79 | 32.84,5.79 32.92,5.79 | 32.92,5.79 32.99,5.79 | 32.99,5.79 34.37,5.79 | 34.37,5.79 34.44,5.79 | 34.44,5.79 34.52,5.79 | 34.52,5.79 35.89,5.79 | 35.89,5.79 35.97,5.79 | 35.97,5.79 36.04,5.79 | 36.04,5.79 37.41,5.79 | 37.41,5.79 37.49,5.79 | 37.49,5.79 37.57,5.79 | J8.37 37.49,6.46 37.49,5.87 | 37.49,5.87 37.49,5.79 | J8.34 35.97,5.87 | 35.97,5.87 35.97,5.79 | J8.31 34.44,6.47 34.44,5.87 | 34.44,5.87 34.44,5.79 | J8.28 32.92,6.45 32.92,5.87 | 32.92,5.87 32.92,5.79 | J8.25 31.47,5.87 | 31.47,5.87 31.47,5.79 | J8.22 29.95,6.48 29.95,5.87 | 29.95,5.87 29.95,5.79 | J8.19 28.42,6.45 28.42,5.87 | 28.42,5.87 28.42,5.79 | J8.16 26.98,6.48 26.98,5.87 | 26.98,5.87 26.98,5.79 | J8.13 25.45,5.87 | 25.45,5.87 25.45,5.79 | J8.10 23.93,6.46 23.93,5.87 | 23.93,5.87 23.93,5.79 | 23.85,5.79 23.93,5.87 | 24,5.79 23.93,5.87 | 22.4,5.79 22.48,5.87 | 22.55,5.79 22.48,5.87 | 22.02,5.79 21.95,5.87 | 25.38,5.79 25.45,5.87 | 25.53,5.79 25.45,5.87 | 26.9,5.79 26.98,5.87 | 27.05,5.79 26.98,5.87
  Bottom 0.152: 28.35,5.79 28.42,5.87 | 28.5,5.79 28.42,5.87 | 29.87,5.79 29.95,5.87 | 30.02,5.79 29.95,5.87 | 31.39,5.79 31.47,5.87 | 31.55,5.79 31.47,5.87 | 32.84,5.79 32.92,5.87 | 32.99,5.79 32.92,5.87 | 34.37,5.79 34.44,5.87 | 34.52,5.79 34.44,5.87 | 35.89,5.79 35.97,5.87 | 36.04,5.79 35.97,5.87 | 37.41,5.79 37.49,5.87 | 37.57,5.79 37.49,5.87 | J8.7 22.48,6.47 22.48,5.87
  Bottom 0.254: v41.5,10.5 v41,10.5 41,9.42 41.23,9.19 J8.S2 | v40.62,6.78 40.23,6.4 39.17,6.4 | 38.94,6.17 39.17,6.4 | J8.S1 16.72,9.19 16.38,9.53 v16.38,10.54 | 39.17,6.4 39.05,6.4 J8.40 | 39.17,6.4 38.94,6.63
  Bottom 0.381: v1.27,10.92 J5.SH3_B | v8.26,19.56 J5.SH1_T | J5.SH4_T v1.27,19.56 | v8.26,10.92 v8.25,10.92 J5.SH2_B | v62.48,21.72 J6.SH_B_1 | v62.48,17.4 J6.SH_B_4 | v69.6,17.4 J6.SH_T_3 | J6.SH_T_2 v67.39,21.72
  other vias: 11.18,7.24 18.67,12.06 16.38,12.06 18.67,10.54 17.53,10.92 79.88,6.22 79.88,7.49 79.88,6.86 5.71,7.95 6.1,7.95 6.48,7.95 5.71,7.57 6.1,7.57 6.48,7.57 6.48,8.33 6.1,8.33 5.71,8.33 23.09,8.23 23.47,8.23 23.85,8.61 23.85,8.23 40.13,24.13 40.51,24.13 40.89,24.13 40.13,23.75 40.13,23.37
  pour Route2 (isolate 0.127, rank 6): -5.08,35.56 106.68,35.56 106.68,-5.08 -5.08,-5.08
  pour Top (no thermals): 7.49,8.76 6.48,8.76 6.48,8.38 4.45,8.38 4.45,7.24 7.87,7.24 7.87,8.13 7.49,8.13
  pour Top (no thermals): 11.43,9.27 10.92,9.27 10.92,5.84 12.45,5.84 12.45,6.1 11.43,6.1
  pour Top (no thermals): 25.15,13.72 25.15,12.45 22.23,12.45 22.23,13.72
  pour Top (no thermals): 79.5,7.8 79.5,5.21 82.42,5.21 82.42,7.8
  pour Top (no thermals): 22.23,8.89 25.15,8.89 25.15,7.49 23.11,7.49 23.11,8.13 22.73,8.13 22.48,8.38 22.23,8.38
  pour Bottom (isolate 0.127, rank 6): -2.54,-2.54 104.14,-2.54 104.14,33.02 -2.54,33.02
  pour Top (no thermals): 41.02,25.02 41.02,23.11 39.88,23.11 39.88,25.02
GPMC0_AD0  (via drill 0.1 pad 0.25)
  Top 0.076: v47.55,14.1 47.17,14.1 47.02,14.25 U1.G28 | v71.6,23.85 71.6,23.19 R51.1
  Bottom 0.076: v47.55,14.1 48.39,13.26 50.52,13.26 53.49,16.23 53.49,20.42 54.18,21.11 57.07,21.11 58.14,22.17 61.42,22.17 62.03,22.78 70.33,22.78 71.4,23.85 v71.6,23.85 71.75,23.7 83.97,23.7 86.49,26.21 86.49,27.13 87.02,27.66 96.32,27.66 97.79,29.13 JP5.39
GPMC0_AD1  (via drill 0.1 pad 0.25)
  Top 0.076: U1.G27 46.5,14.5 47.53,14.5 v47.55,14.48 | v72.59,24 72.64,23.95 R49.1
  Bottom 0.076: v47.55,14.48 48.62,13.41 50.44,13.41 53.34,16.31 53.34,20.5 54.1,21.26 57,21.26 58.06,22.33 61.34,22.33 61.95,22.94 70.26,22.94 71.48,24.16 72.44,24.16 v72.59,24 72.75,23.85 83.9,23.85 86.33,26.29 86.33,27.2 86.94,27.81 93.88,27.81 95.25,29.18 JP5.38
GPMC0_AD2  (via drill 0.1 pad 0.25)
  Top 0.076: v47.93,14.48 47.66,14.75 U1.F28 | v73.58,24.16 73.58,23.24 R42.1
  Bottom 0.076: v47.93,14.48 48.84,13.56 50.37,13.56 53.19,16.38 53.19,20.57 54.03,21.41 56.92,21.41 57.99,22.48 61.27,22.48 61.87,23.09 70.18,23.09 71.4,24.31 73.43,24.31 v73.58,24.16 73.74,24 83.82,24 86.18,26.36 86.18,27.3 86.84,27.96 91.52,27.96 92.71,29.16 JP5.37
GPMC0_AD3  (via drill 0.1 pad 0.25)
  Top 0.076: U1.F27 46.5,15 47.79,15 v48.31,14.48 | v74.57,24.31 74.57,23.27 R41.1
  Bottom 0.076: v48.31,14.48 49.07,13.72 50.29,13.72 53.03,16.46 53.03,20.65 53.95,21.57 56.84,21.57 57.91,22.63 61.19,22.63 61.8,23.24 70.1,23.24 71.32,24.46 74.42,24.46 v74.57,24.31 74.73,24.16 82.36,24.16 84.12,25.92 84.12,27.66 84.58,28.12 89.08,28.12 JP5.36
GPMC0_AD4  (via drill 0.1 pad 0.25)
  Top 0.076: v48.69,14.48 47.92,15.25 U1.E28 | v75.64,24.46 75.69,24.41 R40.1
  Bottom 0.076: v48.69,14.48 49.3,13.87 50.22,13.87 52.88,16.54 52.88,20.73 53.87,21.72 56.77,21.72 57.84,22.78 61.11,22.78 61.72,23.39 70.03,23.39 71.25,24.61 75.49,24.61 v75.64,24.46 75.79,24.31 82.3,24.31 83.97,25.98 83.97,27.74 84.51,28.27 85.65,28.27 86.59,29.21 JP5.35
GPMC0_AD5  (via drill 0.1 pad 0.25)
  Top 0.076: U1.E27 46.5,15.5 48.05,15.5 v49.07,14.48 | R39.1 76.58,23.29 v76.58,24.61
  Bottom 0.076: v49.07,14.48 49.53,14.02 50.14,14.02 52.73,16.61 52.73,20.8 53.8,21.87 56.69,21.87 57.76,22.94 61.04,22.94 61.65,23.55 69.95,23.55 71.17,24.77 76.43,24.77 v76.58,24.61 76.73,24.46 82.22,24.46 83.82,26.06 83.82,27.96 85.06,29.21 JP5.34
GPMC0_AD6  (via drill 0.1 pad 0.25)
  Top 0.076: v49.45,14.48 48.23,15.7 47.09,15.7 47.04,15.75 U1.D28 | v76.96,24.77 76.96,23.93 R38.1
  Bottom 0.076: v49.45,14.48 49.76,14.17 50.06,14.17 52.58,16.69 52.58,20.88 53.72,22.02 56.62,22.02 57.68,23.09 60.96,23.09 61.57,23.7 69.88,23.7 71.09,24.92 76.81,24.92 v76.96,24.77 77.11,24.61 82.14,24.61 83.67,26.14 83.67,28.09 JP5.33
GPMC0_AD7  (via drill 0.1 pad 0.25)
  Top 0.076: v49.84,14.48 48.46,15.85 47.24,15.85 47.09,16 46.5,16 U1.D27 | R37.1 77.34,24.56 v77.34,24.92
  Bottom 0.076: v49.84,14.48 50.14,14.48 52.43,16.76 52.43,20.95 53.65,22.17 56.54,22.17 57.61,23.24 60.88,23.24 61.49,23.85 69.8,23.85 71.02,25.07 77.19,25.07 v77.34,24.92 77.5,24.77 79.93,24.77 81.23,26.06 81.23,28.04 80.06,29.21 JP5.32
GPMC0_AD8
  Top 0.076: U1.L27 46.5,12 47.44,12 52.96,6.48 58.37,6.48 58.83,6.02 69.72,6.02 70.08,5.66 R34.1 70.48,4.88 71.09,4.27 71.09,2.56 JP2.29
GPMC0_AD9
  Top 0.076: U1.L28 47.41,12.25 53.03,6.63 58.45,6.63 58.9,6.17 70.84,6.17 70.99,6.02 70.99,5.84 71.2,5.64 71.5,5.64 | R32.1 71.5,5.64 | 71.5,5.64 71.5,4.7 JP3.29
GPMC0_AD10
  Top 0.076: U1.K27 46.5,12.5 47.39,12.5 53.11,6.78 58.52,6.78 58.98,6.33 68.81,6.33 69.72,7.24 71.86,7.24 72.01,7.09 72.01,5.84 72.19,5.66 R31.1 72.52,5.28 73.69,4.12 73.69,2.52 JP2.30
GPMC0_AD11
  Top 0.076: U1.K28 47.37,12.75 53.19,6.93 58.6,6.93 59.05,6.48 68.73,6.48 69.65,7.39 72.77,7.39 73.03,7.14 73.03,5.84 73.2,5.66 R30.1 73.53,5.21 JP3.30
GPMC0_AD12
  Top 0.076: U1.J28 47.1,13.25 53.26,7.09 58.67,7.09 59.13,6.63 68.66,6.63 69.57,7.54 73.61,7.54 74.04,7.11 74.04,5.84 74.22,5.66 R29.1 74.55,5.08 74.83,4.8 75.51,4.8 76.12,4.19 76.12,2.62 JP2.31
GPMC0_AD13
  Top 0.076: U1.J27 46.5,13.5 47.08,13.5 53.34,7.24 58.75,7.24 59.21,6.78 68.58,6.78 69.49,7.7 74.45,7.7 75.06,7.09 75.06,5.84 75.23,5.66 R28.1 75.56,5.13 75.89,4.8 76.48,4.8 JP3.31
GPMC0_AD14
  Top 0.076: U1.H28 47.06,13.75 53.42,7.39 58.83,7.39 59.28,6.93 68.5,6.93 69.42,7.85 75.36,7.85 76.07,7.14 76.07,5.84 76.25,5.66 R27.1 76.58,5.11 76.81,4.88 78.33,4.88 78.79,4.42 78.79,2.49 JP2.32
GPMC0_AD15
  Top 0.076: U1.H27 46.5,14 47.04,14 53.49,7.54 58.9,7.54 59.36,7.09 68.43,7.09 69.34,8 76.2,8 77.09,7.11 77.09,5.84 77.27,5.66 R26.1 77.6,5.23 77.8,5.03 78.72,5.03 79.93,3.81 JP3.32
GPMC0_ADVN_ALE  (via drill 0.1 pad 0.25)